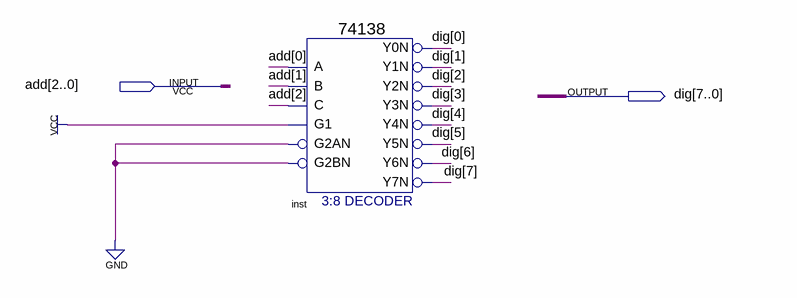
[diagram p0: schematic sheet]
// Quartus schematic dig_select.bdf as structural Verilog: 1 symbols, 2 pins
module dig_select (
  input  [2:0] add,
  output [7:0] dig
);

  \74138  inst (
    .A(add[0]), .B(add[1]), .G1(1'b1), .C(add[2]), .G2AN(1'b0), .G2BN(1'b0), .Y0N(dig[0]), .Y1N(dig[1]),
    .Y2N(dig[2]), .Y3N(dig[3]), .Y4N(dig[4]), .Y5N(dig[5]), .Y6N(dig[6]), .Y7N(dig[7]));
endmodule
